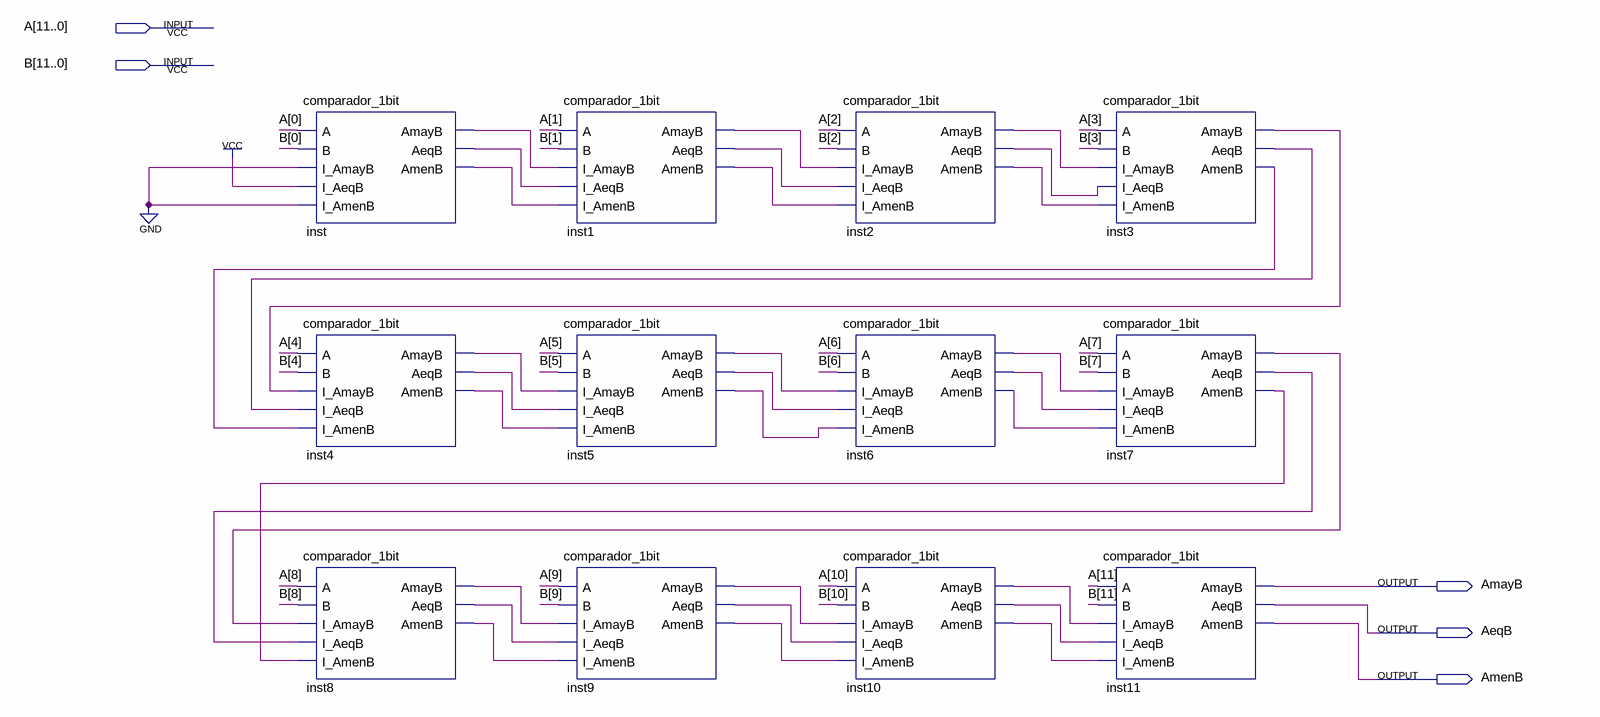
[diagram p0: schematic sheet]
// Quartus schematic comparador_12bits.bdf as structural Verilog: 12 symbols, 5 pins
module comparador_12bits (
  input  [11:0] A,
  input  [11:0] B,
  output AmayB,
  output AeqB,
  output AmenB
);

  wire inst1_aeqb, inst1_amayb, inst1_amenb, inst2_aeqb, inst2_amayb, inst2_amenb, inst3_aeqb, inst3_amayb,
       inst3_amenb, inst4_aeqb, inst4_amayb, inst4_amenb, inst5_aeqb, inst5_amayb, inst5_amenb, inst6_aeqb,
       inst6_amayb, inst6_amenb, inst7_aeqb, inst7_amayb, inst7_amenb, inst8_aeqb, inst8_amayb, inst8_amenb,
       inst9_aeqb, inst9_amayb, inst9_amenb, inst10_aeqb, inst10_amayb, inst10_amenb, inst_aeqb, inst_amayb,
       inst_amenb;

  comparador_1bit inst (
    .A(A[0]), .B(B[0]), .I_AmayB(1'b0), .I_AeqB(1'b1), .I_AmenB(1'b0), .AmayB(inst_amayb), .AeqB(inst_aeqb),
    .AmenB(inst_amenb));
  comparador_1bit inst4 (
    .A(A[4]), .B(B[4]), .I_AmayB(inst3_amayb), .I_AeqB(inst3_aeqb), .I_AmenB(inst3_amenb),
    .AmayB(inst4_amayb), .AeqB(inst4_aeqb), .AmenB(inst4_amenb));
  comparador_1bit inst8 (
    .A(A[8]), .B(B[8]), .I_AmayB(inst7_amayb), .I_AeqB(inst7_aeqb), .I_AmenB(inst7_amenb),
    .AmayB(inst8_amayb), .AeqB(inst8_aeqb), .AmenB(inst8_amenb));
  comparador_1bit inst1 (
    .A(A[1]), .B(B[1]), .I_AmayB(inst_amayb), .I_AeqB(inst_aeqb), .I_AmenB(inst_amenb), .AmayB(inst1_amayb),
    .AeqB(inst1_aeqb), .AmenB(inst1_amenb));
  comparador_1bit inst5 (
    .A(A[5]), .B(B[5]), .I_AmayB(inst4_amayb), .I_AeqB(inst4_aeqb), .I_AmenB(inst4_amenb),
    .AmayB(inst5_amayb), .AeqB(inst5_aeqb), .AmenB(inst5_amenb));
  comparador_1bit inst9 (
    .A(A[9]), .B(B[9]), .I_AmayB(inst8_amayb), .I_AeqB(inst8_aeqb), .I_AmenB(inst8_amenb),
    .AmayB(inst9_amayb), .AeqB(inst9_aeqb), .AmenB(inst9_amenb));
  comparador_1bit inst2 (
    .A(A[2]), .B(B[2]), .I_AmayB(inst1_amayb), .I_AeqB(inst1_aeqb), .I_AmenB(inst1_amenb),
    .AmayB(inst2_amayb), .AeqB(inst2_aeqb), .AmenB(inst2_amenb));
  comparador_1bit inst6 (
    .A(A[6]), .B(B[6]), .I_AmayB(inst5_amayb), .I_AeqB(inst5_aeqb), .I_AmenB(inst5_amenb),
    .AmayB(inst6_amayb), .AeqB(inst6_aeqb), .AmenB(inst6_amenb));
  comparador_1bit inst10 (
    .A(A[10]), .B(B[10]), .I_AmayB(inst9_amayb), .I_AeqB(inst9_aeqb), .I_AmenB(inst9_amenb),
    .AmayB(inst10_amayb), .AeqB(inst10_aeqb), .AmenB(inst10_amenb));
  comparador_1bit inst3 (
    .A(A[3]), .B(B[3]), .I_AmayB(inst2_amayb), .I_AeqB(inst2_aeqb), .I_AmenB(inst2_amenb),
    .AmayB(inst3_amayb), .AeqB(inst3_aeqb), .AmenB(inst3_amenb));
  comparador_1bit inst7 (
    .A(A[7]), .B(B[7]), .I_AmayB(inst6_amayb), .I_AeqB(inst6_aeqb), .I_AmenB(inst6_amenb),
    .AmayB(inst7_amayb), .AeqB(inst7_aeqb), .AmenB(inst7_amenb));
  comparador_1bit inst11 (
    .A(A[11]), .B(B[11]), .I_AmayB(inst10_amayb), .I_AeqB(inst10_aeqb), .I_AmenB(inst10_amenb),
    .AmayB(AmayB), .AeqB(AeqB), .AmenB(AmenB));
endmodule
